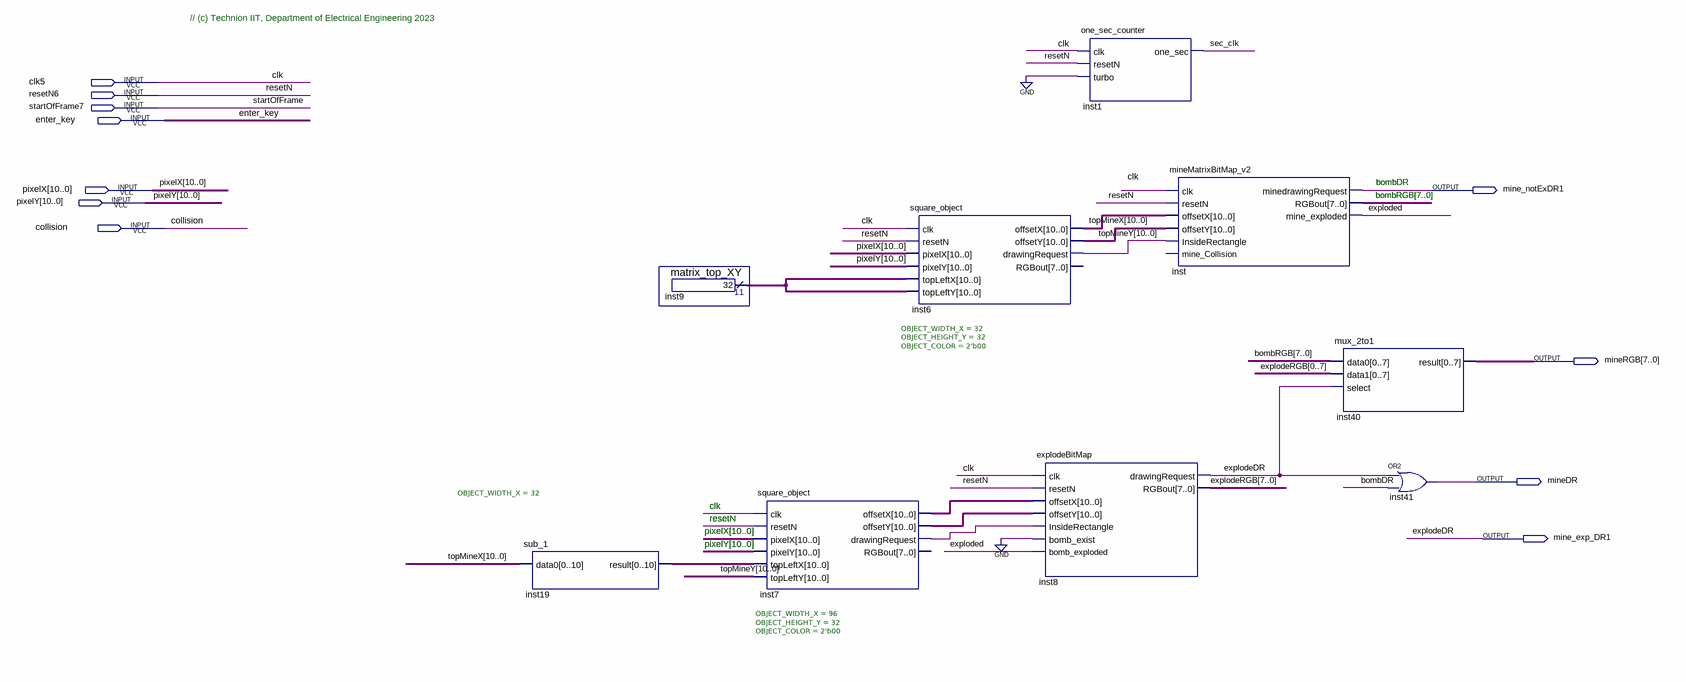
[diagram p0: schematic sheet]
// Quartus schematic mine_Block_T_v2.bdf as structural Verilog: 9 symbols, 11 pins
module mine_Block_T_v2 (
  input  clk5,
  input  resetN6,
  input  startOfFrame7,
  input  enter_key,
  input  [10:0] pixelX,
  input  [10:0] pixelY,
  input  collision,
  output mine_notExDR1,
  output [7:0] mineRGB,
  output mineDR,
  output mine_exp_DR1
);

  wire exploded, inst6_drawingrequest, inst7_drawingrequest, sec_clk;
  wire [7:0] bombRGB, explodeRGB;
  wire [10:0] inst7_offsetx, inst7_offsety, inst9_result, inst19_result, topMineX, topMineY;

  sub_1 #(.OBJECT_WIDTH_X(32)) inst19 (.data0(topMineX), .result(inst19_result));
  matrix_top_XY inst9 (.result(inst9_result));
  square_object #(.OBJECT_WIDTH_X(96), .OBJECT_HEIGHT_Y(32), .OBJECT_COLOR(2'b00)) inst7 (
    .clk(clk5), .resetN(resetN6), .pixelX(pixelX), .pixelY(pixelY), .topLeftX(inst19_result),
    .topLeftY(topMineY), .offsetX(inst7_offsetx), .offsetY(inst7_offsety),
    .drawingRequest(inst7_drawingrequest));  // open: RGBout
  square_object #(.OBJECT_WIDTH_X(32), .OBJECT_HEIGHT_Y(32), .OBJECT_COLOR(2'b00)) inst6 (
    .clk(clk5), .resetN(resetN6), .pixelX(pixelX), .pixelY(pixelY), .topLeftX(inst9_result),
    .topLeftY(inst9_result), .offsetX(topMineX), .offsetY(topMineY), .drawingRequest(inst6_drawingrequest));  // open: RGBout
  explodeBitMap inst8 (
    .clk(clk5), .resetN(resetN6), .offsetX(inst7_offsetx), .offsetY(inst7_offsety),
    .InsideRectangle(inst7_drawingrequest), .bomb_exist(1'b0), .bomb_exploded(exploded),
    .drawingRequest(mine_exp_DR1), .RGBout(explodeRGB));
  one_sec_counter inst1 (.clk(clk5), .resetN(resetN6), .turbo(1'b0), .one_sec(sec_clk));
  mineMatrixBitMap_v2 inst (
    .clk(clk5), .resetN(resetN6), .offsetX(topMineX), .offsetY(topMineY),
    .InsideRectangle(inst6_drawingrequest), .minedrawingRequest(mine_notExDR1), .RGBout(bombRGB),
    .mine_exploded(exploded));  // open: mine_Collision
  mux_2to1 inst40 (
    .data0(bombRGB),
    .data1({explodeRGB[0], explodeRGB[1], explodeRGB[2], explodeRGB[3], explodeRGB[4], explodeRGB[5], explodeRGB[6], explodeRGB[7]}),
    .select(mine_exp_DR1), .result(mineRGB));
  or inst41 (mineDR, mine_exp_DR1, mine_notExDR1);

  // Other names for the same wires on the sheet: bombDR = mine_notExDR1; clk = clk5; explodeDR = mine_exp_DR1;
  //   resetN = resetN6; startOfFrame = startOfFrame7

  // Notes on the sheet:
  //   // (c) Technion IIT, Department of Electrical Engineering 2023
  //   bombDR
  //   bombRGB[7..0]
  //   clk
  //   resetN
  //   pixelX[10..0]
  //   pixelY[10..0]
endmodule
